# Altium schematic sheet main.SchDoc
size A4; SheetNumber: 1; SheetTotal: 6
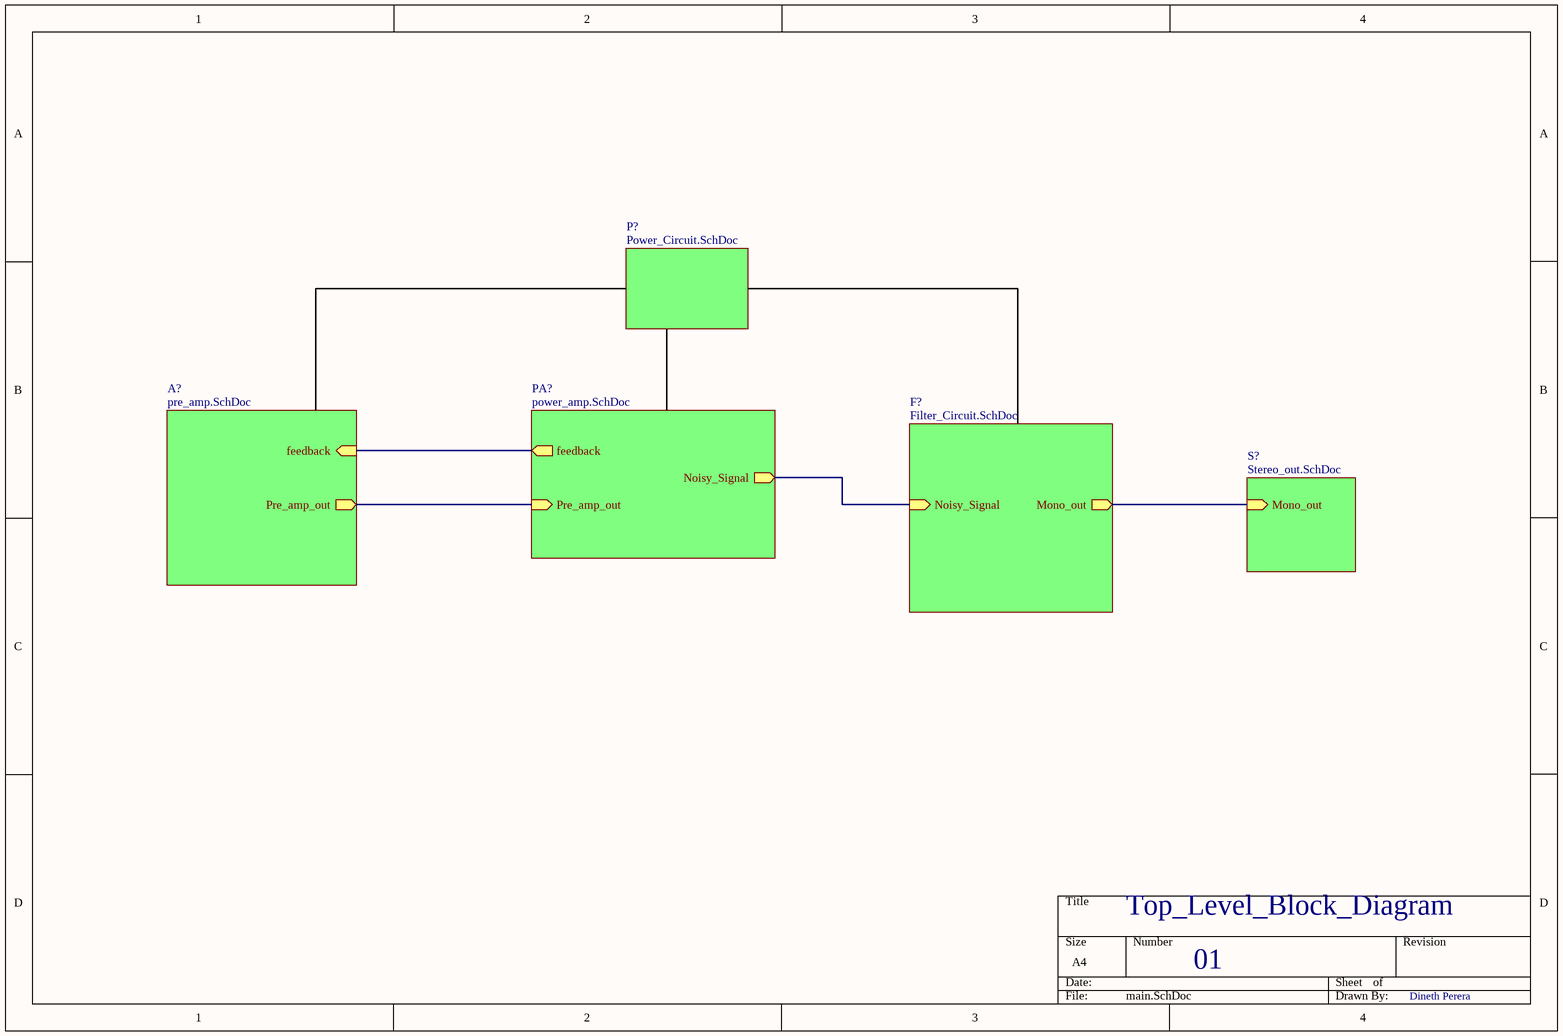
[diagram p0: main.SchDoc]

## Sub-sheets
A? = pre_amp.SchDoc: feedback (in), Pre_amp_out (out)
F? = Filter_Circuit.SchDoc: Noisy_Signal (in), Mono_out (out)
P? = Power_Circuit.SchDoc: no entries
PA? = power_amp.SchDoc: feedback (out), Pre_amp_out (in), Noisy_Signal (out)
S? = Stereo_out.SchDoc: Mono_out (in)

## Nets
(unnamed): sheet A?/feedback, sheet PA?/feedback
(unnamed): sheet A?/Pre_amp_out, sheet PA?/Pre_amp_out
(unnamed): sheet PA?/Noisy_Signal, sheet F?/Noisy_Signal
(unnamed): sheet F?/Mono_out, sheet S?/Mono_out

## Notes on the sheet
- Top_Level_Block_Diagram
- 01
- Dineth Perera